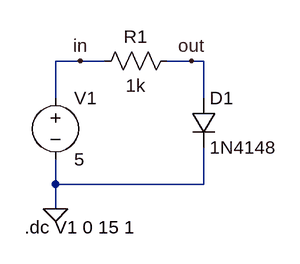
[diagram p0: schematic Draft2a.asc]
Draft2a.asc, the LTspice schematic file:
Version 4.1
SHEET 1 880 680
WIRE 144 80 112 80
WIRE 176 80 144 80
WIRE 288 80 256 80
WIRE 304 80 288 80
WIRE 112 128 112 80
WIRE 304 128 304 80
WIRE 112 240 112 208
WIRE 304 240 304 192
WIRE 304 240 112 240
WIRE 112 272 112 240
FLAG 112 272 0
FLAG 144 80 in
FLAG 288 80 out
SYMBOL res 272 64 R90
WINDOW 0 0 56 VBottom 2
WINDOW 3 32 56 VTop 2
SYMATTR InstName R1
SYMATTR Value 1k
SYMBOL voltage 112 112 R0
SYMATTR InstName V1
SYMATTR Value 5
SYMBOL diode 288 128 R0
SYMATTR InstName D1
SYMATTR Value 1N4148
TEXT 72 296 Left 2 !.dc V1 0 15 1

The netlist it stands for:
* Draft2a.asc
R1 out in 1k
V1 in 0 5
D1 out 0 1N4148
.model D D
.lib standard.dio
.dc V1 0 15 1
.backanno
.end